# EAGLE schematic ESPF (EAGLE 9.6.1)
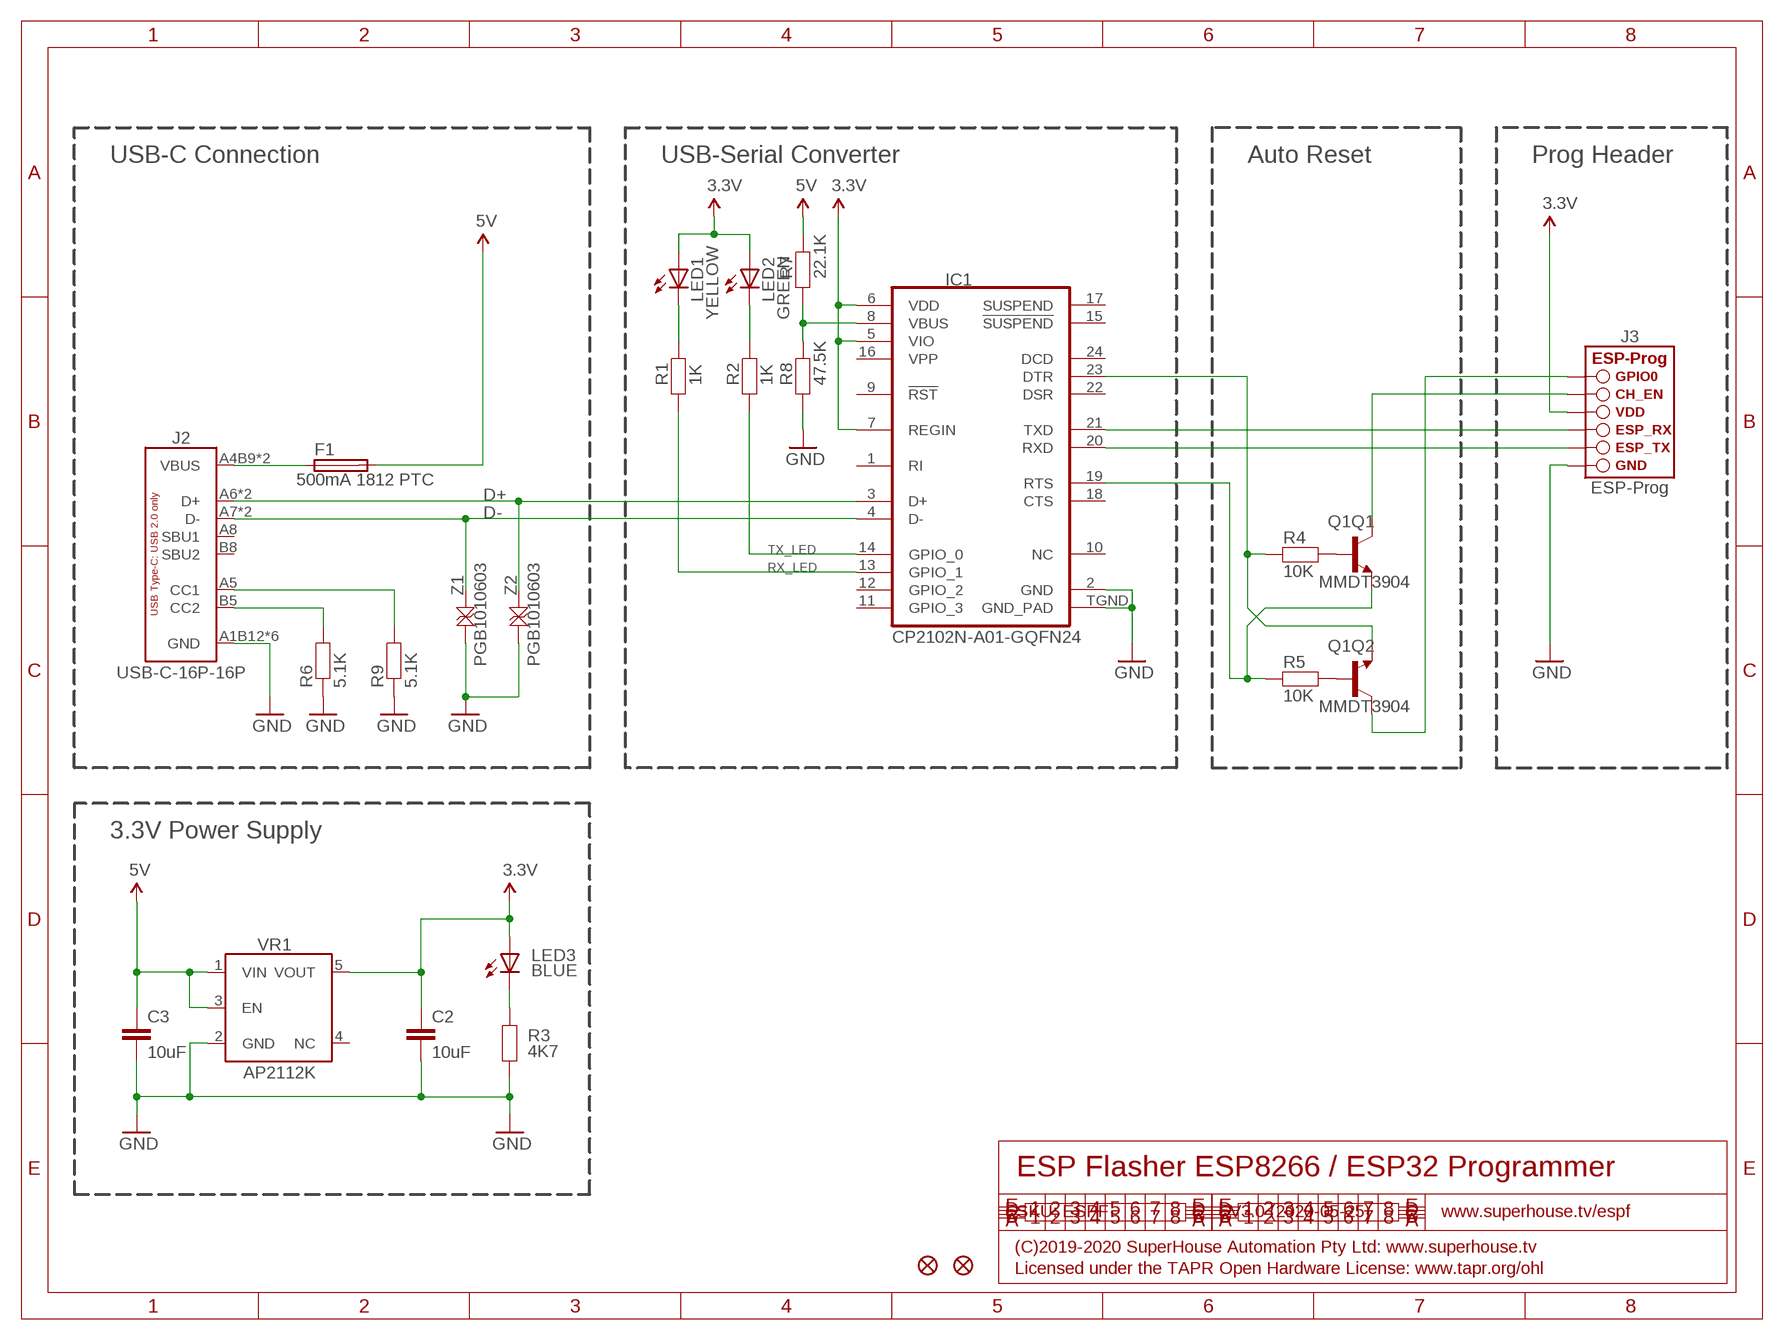
[diagram p0: schematic, sheet 1]

## Parts
C2  10uF  CAP0805  [C0805]
C3  10uF  CAP0805  [C0805]
F1  500mA 1812 PTC  PTC050  [1812]
FID1  FIDUCIAL1X2.5  [FIDUCIAL-1X2.5]
FID2  FIDUCIAL1X2.5  [FIDUCIAL-1X2.5]
IC1  CP2102N-A01-GQFN24  CP2104  [QFN-24]
J2  USB-C-16P-16P  [USB-C-16P]
J3  ESP-PROG-1X6-2.54-PINS-RA  [1X6-2.54-PINS-RA]
LED1  YELLOW  LED0603  [LED-0603]
LED2  GREEN  LED0603  [LED-0603]
LED3  BLUE  LED0603  [LED-0603]
Q1  MMDT3904  TRANS_NPN_DUAL-MMDT3904  [SOT-363]
R1  1K  RESISTOR0603  [R0603]
R2  1K  RESISTOR0603  [R0603]
R3  4K7  RESISTOR0603  [R0603]
R4  10K  RESISTOR0603  [R0603]
R5  10K  RESISTOR0603  [R0603]
R6  5.1K  RESISTOR0603  [R0603]
R7  22.1K  RESISTOR0603  [R0603]
R8  47.5K  RESISTOR0603  [R0603]
R9  5.1K  RESISTOR0603  [R0603]
VR1  AP2112KSOT25  [SOT23-5]
Z1  PGB1010603  TVS0603  [TVS0603]
Z2  PGB1010603  TVS0603  [TVS0603]

## Nets
3.3V: C2.1 IC1.5(VIO) IC1.6(VDD) IC1.7(REGIN) J3.4(VDD) LED1.A LED2.A LED3.A VR1.5(VOUT)
5V: C3.1 F1.2 R7.2 VR1.1(VIN) VR1.3(EN)
D+: IC1.3(D+) J2.A6(D+) J2.B6(D+) Z2.2
D-: IC1.4(D-) J2.A7(D-) J2.B7(D-) Z1.2
DTR: IC1.23(DTR) Q1.1(Q2:E) R4.1
EN: J3.5(CH_EN) Q1.3(Q1:C)
GND: C2.2 C3.2 IC1.2(GND) IC1.TGND(GND_PAD) J2.A1B12(GND) J2.A12B1(GND) J2.FIX1(GND) J2.FIX2(GND) J2.FIX3(GND) J2.FIX4(GND) J3.1(GND) R3.1 R6.1 R8.1 R9.1 VR1.2(GND) Z1.1 Z2.1
GPIO0: J3.6(GPIO0) Q1.6(Q2:C)
N$3: LED1.C R1.2
N$4: LED2.C R2.2
N$5: LED3.C R3.2
N$6: IC1.8(VBUS) R7.1 R8.2
N$7: Q1.5(Q1:B) R4.2
N$8: Q1.2(Q2:B) R5.2
N$9: J2.B5(CC2) R6.2
N$10: J2.A5(CC1) R9.2
RTS: IC1.19(RTS) Q1.4(Q1:E) R5.1
RX_LED: IC1.13(GPIO_1) R1.1
RXI: IC1.20(RXD) J3.2(ESP_TX)
TX_LED: IC1.14(GPIO_0) R2.1
TXO: IC1.21(TXD) J3.3(ESP_RX)
VIN: F1.1 J2.A4B9(VBUS) J2.A9B4(VBUS)
Unconnected: IC1.1(RI) IC1.9(!RST) IC1.10(NC) IC1.11(GPIO_3) IC1.12(GPIO_2) IC1.15(!SUSPEND) IC1.16(VPP) IC1.17(SUSPEND) IC1.18(CTS) IC1.22(DSR) IC1.24(DCD) J2.A8(SBU1) J2.B8(SBU2) VR1.4(NC)

## Notes on the sheet
- USB-C Connection | USB-Serial Converter | Auto Reset | Prog Header
- 3.3V Power Supply
- ESP Flasher ESP8266 / ESP32 Programmer
- SKU: ESPF | V3.0 (2020-05-25) | www.superhouse.tv/espf
- (C)2019-2020 SuperHouse Automation Pty Ltd: www.superhouse.tv
- Licensed under the TAPR Open Hardware License: www.tapr.org/ohl

## Library data of the parts
C2 C3 = SuperHouse-DiscreteSemi:CAP: Capacitor Standard ceramic capacitor
F1 = SuperHouse-Fuses:PTC: MF-SMDF Series - PRC Resettable Fuses Source: http://www.farnell.com/datasheets/716597.pdf
FID1 FID2 = freetronics:FIDUCIAL: Fiducial Alignment Points Various fiducial points for machine vision alignment.
IC1 = SuperHouse-ICs:CP2104: CP2104 / CP2102N-A01-GQFN24 CP2104 USB to serial converter. The CP2104 is not recommended for new designs: replace with CP2102N-A01-GQFN24.
J2 = SuperHouse-Connectors:USB-C-16P: USB-C socket with 16 pins, suitable only for backward compatibility with USB 2
J3 = SuperHouse-ESP-Prog:ESP-PROG: ESP-Prog ESP-Prog programming header for ESP8266, ESP8285, and ESP32. Options for both 1x6 and 2x3 formats, in 2.54mm (0.1") and 1.27mm (0.05") pitch.
LED1-LED3 = SuperHouse-LEDs:LED: LEDs Standard schematic elements and footprints for 5mm, 3mm, 1206, and 0603 sized LEDs. 5mm - Spark Fun Electronics SKU : COM-00529 (and others)
Q1 = SuperHouse-DiscreteSemi:TRANS_NPN_DUAL: MMDT3904 Dual 3904 NPN transistors. Datasheet <http://www.onsemi.com/pub_link/Collateral/MBT3904DW1T1-D.PDF>; PROD_ID: TRANS-13337
R1-R9 = SuperHouse-DiscreteSemi:RESISTOR: Resistor Standard resistors.
VR1 = SuperHouse-Regulators:AP2112K: AP2112K LDO linear voltage regulator
Z1 Z2 = SuperHouse-DiscreteSemi:TVS: TVS voltage protection Zener

## Net classes
0 default: width 0.152 mm, drill 0.241 mm, clearance 0.152 mm